# Altium schematic sheet Sensors.SchDoc
size B; SheetNumber: 3; SheetTotal: 7
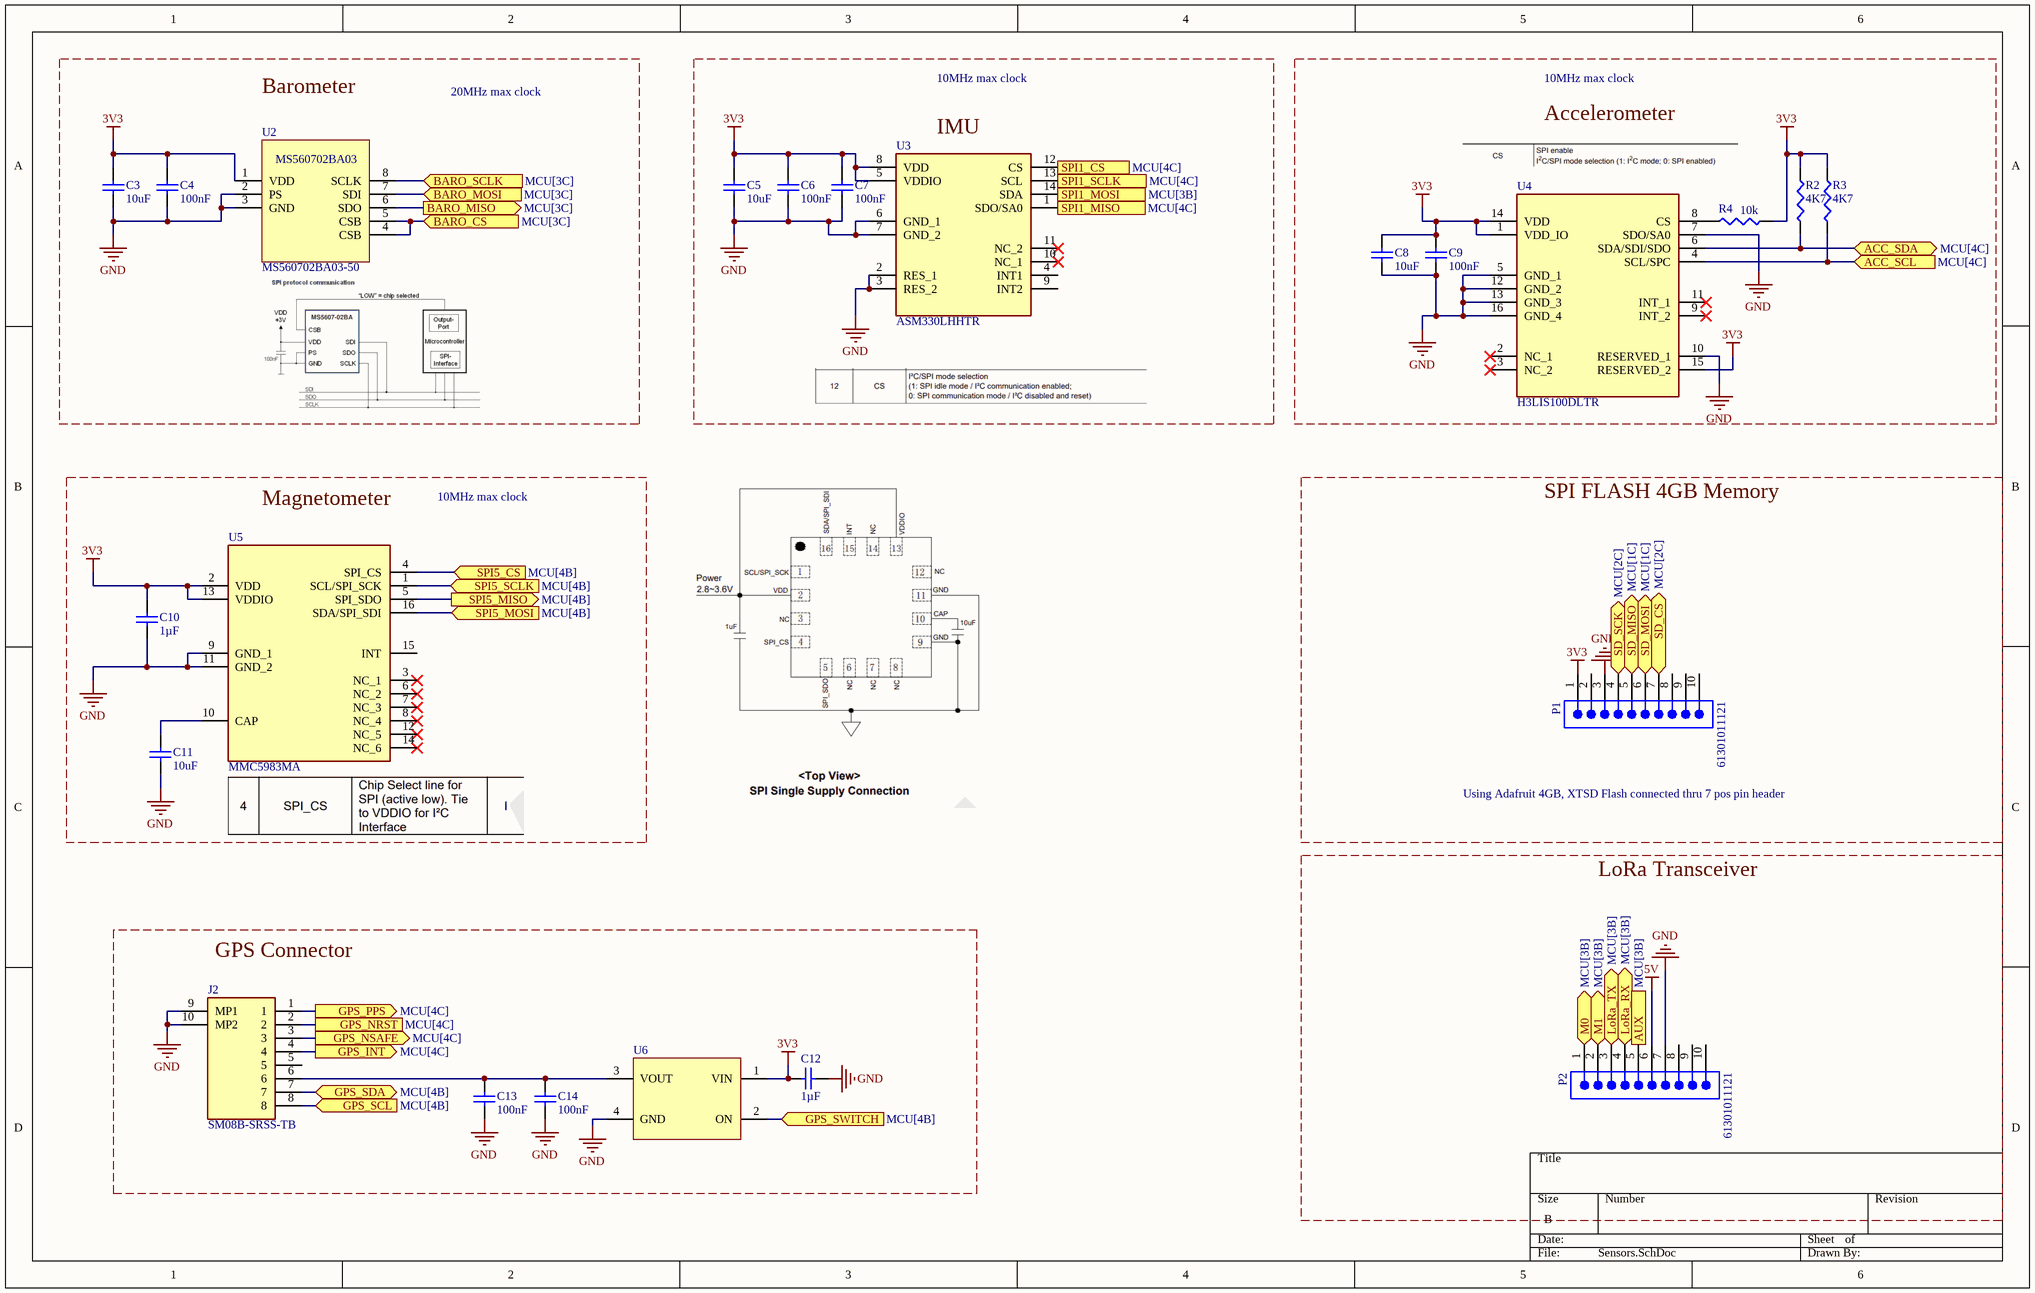
[diagram p0: Sensors.SchDoc]

## Parts
C3  10uF  [0402_C]
C4  100nF  [0402_C]
C5  10uF  [0402_C]
C6  100nF  [0402_C]
C7  100nF  [0402_C]
C8  10uF  [0402_C]
C9  100nF  [0402_C]
C10  value 1µF  [0402_C]  (hidden comment: CL05A105KL5NRNC)
C11  10uF  [0402_C]
C12  value 1µF  [0402_C]  (hidden comment: CL05A105KL5NRNC)
C13  100nF  [0402_C]
C14  100nF  [0402_C]
J2  SM08B-SRSS-TB  [SM08BSRSSTBLFSN]
P1  61301011121  [61301011121]
P2  61301011121  [61301011121]
R2  4K7  [0402_R]
R3  4K7  [0402_R]
R4  10k  [0402_R]
U2  MS560702BA03-50  [MS5607-02BA03]
U3  ASM330LHHTR  [LSM6DS3USTR]
U4  H3LIS100DLTR  [H3LIS100DLTR]
U5  MMC5983MA  [MMC5983MA_MEM]
U6  TPS22991BNRAAR  [TPS22991BNRAAR-Footprint-1]  (value not drawn)

## Blocks framed on the sheet
Barometer: C3 C4 U2
IMU: C5-C7 U3
Accelerometer: C8 C9 R2-R4 U4
Magnetometer: C10 C11 U5
SPI FLASH 4GB Memory: P1
LoRa Transceiver: P2
GPS Connector: C12-C14 J2 U6

## Ports
ACC_SCL (in, see MCU[4C]), ACC_SDA (bidir, see MCU[4C]), AUX (out, see MCU[3B]), BARO_CS (in, see MCU[3C]), BARO_MISO (out, see MCU[3C]), BARO_MOSI (in, see MCU[3C]), BARO_SCLK (in, see MCU[3C]), GPS_INT (out, see MCU[4C]), GPS_NRST (see MCU[4C]), GPS_NSAFE (out, see MCU[4C]), GPS_PPS (out, see MCU[4C]), GPS_SCL (in, see MCU[4B]), GPS_SDA (bidir, see MCU[4B]), GPS_SWITCH (in, see MCU[4B]), LoRa_RX (bidir, see MCU[3B]), LoRa_TX (bidir, see MCU[3B]), M0 (bidir, see MCU[3B]), M1 (bidir, see MCU[3B]), SD_CS (bidir, see MCU[2C]), SD_MISO (bidir, see MCU[1C]), SD_MOSI (bidir, see MCU[1C]), SD_SCK (bidir, see MCU[2C]), SPI1_CS (in, see MCU[4C]), SPI1_MISO (out, see MCU[4C]), SPI1_MOSI (in, see MCU[3B]), SPI1_SCLK (in, see MCU[4C]), SPI5_CS (in, see MCU[4B]), SPI5_MISO (out, see MCU[4B]), SPI5_MOSI (in, see MCU[4B]), SPI5_SCLK (in, see MCU[4B])

## Nets
3V3: C3.2 C4.2 C5.2 C6.2 C7.2 C8.2 C9.2 C10.2 C12.2 P1.1 R2.2 R3.2 R4.2 U2.1(VDD) U3.5(VDDIO) U3.8(VDD) U4.1(VDD_IO) U4.14(VDD) U4.15(RESERVED_2) U5.2(VDD) U5.13(VDDIO) U6.1(VIN)
5V: P2.6
GND: C3.1 C4.1 C5.1 C6.1 C7.1 C8.1 C9.1 C10.1 C11.1 C12.1 C13.1 C14.1 J2.9(MP1) J2.10(MP2) P1.3 P2.7 U2.2(PS) U2.3(GND) U3.2(RES_1) U3.3(RES_2) U3.6(GND_1) U3.7(GND_2) U4.5(GND_1) U4.7(SDO/SA0) U4.10(RESERVED_1) U4.12(GND_2) U4.13(GND_3) U4.16(GND_4) U5.9(GND_1) U5.11(GND_2) U6.4(GND)
ACC_SCL: R3.1 U4.4(SCL/SPC) ; port ACC_SCL
ACC_SDA: R2.1 U4.6(SDA/SDI/SDO) ; port ACC_SDA
AUX: P2.5 ; port AUX
BARO_CS: U2.4(CSB) U2.5(CSB) ; port BARO_CS
BARO_MISO: U2.6(SDO) ; port BARO_MISO
BARO_MOSI: U2.7(SDI) ; port BARO_MOSI
BARO_SCLK: U2.8(SCLK) ; port BARO_SCLK
GPS_INT: J2.4 ; port GPS_INT
GPS_NRST: J2.2 ; port GPS_NRST
GPS_NSAFE: J2.3 ; port GPS_NSAFE
GPS_PPS: J2.1 ; port GPS_PPS
GPS_SCL: J2.8 ; port GPS_SCL
GPS_SDA: J2.7 ; port GPS_SDA
GPS_SWITCH: U6.2(ON) ; port GPS_SWITCH
LoRa_RX: P2.4 ; port LoRa_RX
LoRa_TX: P2.3 ; port LoRa_TX
M0: P2.1 ; port M0
M1: P2.2 ; port M1
SD_CS: P1.7 ; port SD_CS
SD_MISO: P1.5 ; port SD_MISO
SD_MOSI: P1.6 ; port SD_MOSI
SD_SCK: P1.4 ; port SD_SCK
SPI1_CS: U3.12(CS) ; port SPI1_CS
SPI1_MISO: U3.1(SDO/SA0) ; port SPI1_MISO
SPI1_MOSI: U3.14(SDA) ; port SPI1_MOSI
SPI1_SCLK: U3.13(SCL) ; port SPI1_SCLK
SPI5_CS: U5.4(SPI_CS) ; port SPI5_CS
SPI5_MISO: U5.5(SPI_SDO) ; port SPI5_MISO
SPI5_MOSI: U5.16(SDA/SPI_SDI) ; port SPI5_MOSI
SPI5_SCLK: U5.1(SCL/SPI_SCK) ; port SPI5_SCLK
NetC11_2: C11.2 U5.10(CAP)
NetC13_2: C13.2 C14.2 J2.6 U6.3(VOUT)
NetR4_1: R4.1 U4.8(CS)

Not connected (* = marked no-connect by the designer): J2 5; P1 2 8 9 10; P2 8 9 10; U3 4(INT1) 9(INT2) 10(NC_1)* 11(NC_2)*; U4 2(NC_1)* 3(NC_2)* 9(INT_2)* 11(INT_1)*; U5 3(NC_1)* 6(NC_2)* 7(NC_3)* 8(NC_4)* 12(NC_5)* 14(NC_6)* 15(INT)

## Notes on the sheet
- 20MHz max clock
- 10MHz max clock
- Using Adafruit 4GB, XTSD Flash connected thru 7 pos pin header
- (in symbol MS560702BA03-50) MS560702BA03

## Library data of the parts
C3 C5 C8 C11 = C_10uF_0402: Ceramic Capacitor, Multilayer, Ceramic, 10V, 20% +Tol, 20% -Tol, X5R, +-15% TC, 10uF, Surface Mount, 0402 inch; Manufacturer: Samsung Electro-Mechanics; Manufacturer Part Number: CL05A106MP5NUNC; Value: 10µF; LCSC Part #: C315248; Supplier: DigiKey; Supplier Part Number: 1276-1450-1-ND; RoHS: Compliant; Category: Ceramic Capacitors; Stock: 1973072; Pricing: 1=0.08, 10=0.038, 50=0.034, 100=0.0296, 500=0.0272, 1000=0.02, 2500=0.01844 (USD); Case/Package: 0402; Case Code (Imperial): 0402; Case Code (Metric): 1005; China RoHS: Compliant; Contact Plating: Tin; Depth: 500µm; Dielectric: X5R; Dielectric Material: Ceramic; Height: 700µm; Lead Free: Lead Free; Length: 1mm; Lifecycle Status: NRND; Material: Ceramic; Max Operating Temperature: 85°C; Min Operating Temperature: -55°C; Mounting Technology: Surface Mount; Number of Terminals: 2; Packaging: Tape and Reel; Radiation Hardening: No; REACH SVHC: Yes; Schedule B: 8532240020, 8532240020|8532240020|8532240020|8532240020|8532240020|8532240020|8532240020|8532240020|8532240020|8532240020|8532240020|8532240020|8532240020|8532240020|8532240020|8532240020|8532240020|8532240020|8532240020|8532240020|8532240020|8532240020|8532240020|85; Termination: Wraparound; Thickness: 711.2µm; Tolerance: 20%; Voltage Rating: 10V; Voltage Rating (DC): 10V; Width: 500µm; ComponentLink1URL: https://datasheet.octopart.com:443/CL05A106MP5NUNC-Samsung-Electro-Mechanics-datasheet-182018593.pdf?src-supplier=IHS; ComponentLink1Description: https://datasheet.octopart.com:443/CL05A106MP5NUNC-Samsung-Electro-Mechanics-datasheet-182018593.pdf?src-supplier=IHS; ComponentLink2URL: https://datasheet.octopart.com:443/CL05A106MP5NUNC-Samsung-Electro-Mechanics-datasheet-136031723.pdf?src-supplier=Upverter; ComponentLink2Description: https://datasheet.octopart.com:443/CL05A106MP5NUNC-Samsung-Electro-Mechanics-datasheet-136031723.pdf?src-supplier=Upverter; ComponentLink3URL: https://datasheet.octopart.com:443/CL05A106MP5NUNC-Samsung-Electro-Mechanics-datasheet-110226206.pdf?src-supplier=Future+Electronics; ComponentLink3Description: https://datasheet.octopart.com:443/CL05A106MP5NUNC-Samsung-Electro-Mechanics-datasheet-110226206.pdf?src-supplier=Future+Electronics; ComponentLink4URL: https://datasheet.octopart.com:443/CL05A106MP5NUNC-Samsung-Electro-Mechanics-datasheet-87580039.pdf?src-supplier=Future+Electronics; ComponentLink4Description: https://datasheet.octopart.com:443/CL05A106MP5NUNC-Samsung-Electro-Mechanics-datasheet-87580039.pdf?src-supplier=Future+Electronics; ComponentLink5URL: https://datasheet.octopart.com:443/CL05A106MP5NUNC-Samsung-Electro-Mechanics-datasheet-81461595.pdf?src-supplier=Future+Electronics; ComponentLink5Description: https://datasheet.octopart.com:443/CL05A106MP5NUNC-Samsung-Electro-Mechanics-datasheet-81461595.pdf?src-supplier=Future+Electronics; ComponentLink6URL: https://datasheet.octopart.com:443/CL05A106MP5NUNC-Samsung-datasheet-42280527.pdf?src-supplier=Future+Electronics; ComponentLink6Description: https://datasheet.octopart.com:443/CL05A106MP5NUNC-Samsung-datasheet-42280527.pdf?src-supplier=Future+Electronics; ComponentLink7URL: https://datasheet.octopart.com:443/CL05A106MP5NUNC-Samsung-datasheet-34153002.pdf?src-supplier=Future+Electronics; ComponentLink7Description: https://datasheet.octopart.com:443/CL05A106MP5NUNC-Samsung-datasheet-34153002.pdf?src-supplier=Future+Electronics; ComponentLink8URL: https://datasheet.octopart.com:443/CL05A106MP5NUNC-Samsung-datasheet-25077983.pdf?src-supplier=Future+Electronics; ComponentLink8Description: https://datasheet.octopart.com:443/CL05A106MP5NUNC-Samsung-datasheet-25077983.pdf?src-supplier=Future+Electronics; ComponentLink9URL: https://datasheet.octopart.com:443/CL05A106MP5NUNC-Samsung-Electro-Mechanics-datasheet-149136670.pdf?src-supplier=Future+Electronics; ComponentLink9Description: https://datasheet.octopart.com:443/CL05A106MP5NUNC-Samsung-Electro-Mechanics-datasheet-149136670.pdf?src-supplier=Future+Electronics; ComponentLink10URL: https://datasheet.octopart.com:443/CL05A106MP5NUNC-Samsung-datasheet-8326407.pdf?src-supplier=TME; ComponentLink10Description: https://datasheet.octopart.com:443/CL05A106MP5NUNC-Samsung-datasheet-8326407.pdf?src-supplier=TME
C4 C6 C7 C9 C13 C14 = C_100nF_0402: Ceramic Capacitor, Multilayer, Ceramic, 16V, 10% +Tol, 10% -Tol, X7R, +-15% TC, 100nF, Surface Mount, 0402 inch; Manufacturer: Samsung Electro-Mechanics; Manufacturer Part Number: CL05B104KO5NNNC; Supplier: DigiKey; Supplier Part Number: 1276-1001-1-ND; RoHS: Compliant; Category: Ceramic Capacitors; Stock: 253470; Pricing: 1=0.08, 10=0.009, 50=0.0076, 100=0.0064, 500=0.0056, 1000=0.004, 2500=0.00394 (USD); Value: 100nF; Case/Package: 0402; Case Code (Imperial): 0402; Case Code (Metric): 1005; China RoHS: Compliant; Contact Plating: Tin; Depth: 500µm; Dielectric: X7R; Dielectric Material: Ceramic; Height: 500µm; Lead Free: Lead Free; Length: 1mm; Lifecycle Status: Production; Material: Ceramic; Max Operating Temperature: 125°C; Min Operating Temperature: -55°C; Mounting Technology: Surface Mount; Number of Terminals: 2; Radiation Hardening: No; REACH SVHC: Yes; Schedule B: 8532240020, 8532240020|8532240020|8532240020|8532240020|8532240020|8532240020|8532240020|8532240020|8532240020|8532240020|8532240020|8532240020|8532240020|8532240020|8532240020|8532240020|8532240020|8532240020|8532240020|8532240020|8532240020|8532240020|8532240020|85; Thickness: 558.8µm; Tolerance: 10%; Voltage: 16V; Voltage Rating: 16V; Voltage Rating (DC): 16V; Width: 500µm; ComponentLink1URL: https://datasheet.octopart.com:443/CL05B104KO5NNNC-Samsung-Electro-Mechanics-datasheet-181960518.pdf?src-supplier=IHS; ComponentLink1Description: https://datasheet.octopart.com:443/CL05B104KO5NNNC-Samsung-Electro-Mechanics-datasheet-181960518.pdf?src-supplier=IHS; ComponentLink2URL: https://datasheet.octopart.com:443/CL05B104KO5NNNC-Samsung-Electro-Mechanics-datasheet-81461623.pdf?src-supplier=Upverter; ComponentLink2Description: https://datasheet.octopart.com:443/CL05B104KO5NNNC-Samsung-Electro-Mechanics-datasheet-81461623.pdf?src-supplier=Upverter; ComponentLink3URL: https://datasheet.octopart.com/CL05B104KO5NNNC-Samsung-Electro-Mechanics-datasheet-8324245.pdf; ComponentLink3Description: https://datasheet.octopart.com/CL05B104KO5NNNC-Samsung-Electro-Mechanics-datasheet-8324245.pdf; ComponentLink4URL: https://datasheet.octopart.com/CL05B104KO5NNNC-Samsung-Electro-Mechanics-datasheet-97040617.pdf; ComponentLink4Description: https://datasheet.octopart.com/CL05B104KO5NNNC-Samsung-Electro-Mechanics-datasheet-97040617.pdf; ComponentLink5URL: https://datasheet.octopart.com/General-Multilayer-Ceramic-Capacitors-Samsung-datasheet-family-111.pdf; ComponentLink5Description: https://datasheet.octopart.com/General-Multilayer-Ceramic-Capacitors-Samsung-datasheet-family-111.pdf; ComponentLink6URL: https://datasheet.octopart.com:443/CL05B104KO5NNNC-Samsung-Electro-Mechanics-datasheet-141346863.pdf?src-supplier=Samsung+SCT; ComponentLink6Description: https://datasheet.octopart.com:443/CL05B104KO5NNNC-Samsung-Electro-Mechanics-datasheet-141346863.pdf?src-supplier=Samsung+SCT; ComponentLink7URL: https://datasheet.octopart.com:443/CL05B104KO5NNNC-Samsung-datasheet-151956582.pdf?src-supplier=SOS+electronic; ComponentLink7Description: https://datasheet.octopart.com:443/CL05B104KO5NNNC-Samsung-datasheet-151956582.pdf?src-supplier=SOS+electronic; ComponentLink8URL: https://datasheet.octopart.com:443/CL05B104KO5NNNC-Samsung-datasheet-42485123.pdf?src-supplier=Future+Electronics; ComponentLink8Description: https://datasheet.octopart.com:443/CL05B104KO5NNNC-Samsung-datasheet-42485123.pdf?src-supplier=Future+Electronics; ComponentLink9URL: https://datasheet.octopart.com:443/CL05B104KO5NNNC-Samsung-datasheet-34153835.pdf?src-supplier=Future+Electronics; ComponentLink9Description: https://datasheet.octopart.com:443/CL05B104KO5NNNC-Samsung-datasheet-34153835.pdf?src-supplier=Future+Electronics; ComponentLink10URL: https://datasheet.octopart.com:443/CL05B104KO5NNNC-Samsung-datasheet-26589024.pdf?src-supplier=Future+Electronics; ComponentLink10Description: https://datasheet.octopart.com:443/CL05B104KO5NNNC-Samsung-datasheet-26589024.pdf?src-supplier=Future+Electronics; ComponentLink11URL: https://datasheet.octopart.com:443/CL05B104KO5NNNC-Samsung-Electro-Mechanics-datasheet-149136714.pdf?src-supplier=Future+Electronics; ComponentLink11Description: https://datasheet.octopart.com:443/CL05B104KO5NNNC-Samsung-Electro-Mechanics-datasheet-149136714.pdf?src-supplier=Future+Electronics; ComponentLink12URL: https://datasheet.octopart.com:443/CL05B104KO5NNNC-Samsung-datasheet-59220082.pdf?src-supplier=TME; ComponentLink12Description: https://datasheet.octopart.com:443/CL05B104KO5NNNC-Samsung-datasheet-59220082.pdf?src-supplier=TME; ComponentLink13URL: http://sigma.octopart.com:80/rohs_certificate/General-Multilayer-Ceramic-Capacitors-Samsung-family-110.pdf?src-supplier=Compliance+Statements; ComponentLink13Description: http://sigma.octopart.com:80/rohs_certificate/General-Multilayer-Ceramic-Capacitors-Samsung-family-110.pdf?src-supplier=Compliance+Statements; ComponentLink14URL: http://sigma.octopart.com:80/rohs_statement/General-Multilayer-Ceramic-Capacitors-Samsung-family-132.pdf?src-supplier=Compliance+Statements; ComponentLink14Description: http://sigma.octopart.com:80/rohs_statement/General-Multilayer-Ceramic-Capacitors-Samsung-family-132.pdf?src-supplier=Compliance+Statements; ComponentLink15URL: http://sigma.octopart.com:80/reach_statement/General-Multilayer-Ceramic-Capacitors-Samsung-family-133.pdf?src-supplier=Compliance+Statements; ComponentLink15Description: http://sigma.octopart.com:80/reach_statement/General-Multilayer-Ceramic-Capacitors-Samsung-family-133.pdf?src-supplier=Compliance+Statements; LCSC Part #: C1525
C10 C12 = CMP-001-00091-2: Ceramic Capacitor, Multilayer, Ceramic, 35V, 10% +Tol, 10% -Tol, X5R, 15% TC, 1uF, Surface Mount, 0402; Manufacturer: Samsung; Tolerance: 1%; Working Voltage: 50V; Temperature Coefficient: 100ppm/°C; Rated Temperature: 70°C; Power: 62.5mW; Multilayer: Yes; Reference Standard: AEC-Q200; Package Height: 0.32mm; Additional Feature: LASER TRIMMABLE; Package Width: 0.5mm; Package Length: 1mm; RoHS Compliant: Yes; Rated DC Voltage (URdc): 35V; Termination: Wraparound; ComponentLink1URL: https://datasheet.ciiva.com:443/pdfs/VipMasterIC/IC/SEMS/SEMS-S-A0008384515/SEMS-S-A0008872905-1.pdf?src-supplier=IHS+Markit; Tolerance  (fill in as +-): 10%; Technology: METAL GLAZE/THICK FILM; Construction: Chip; Max Operating Temperature: 85°C; ComponentLink2URL: http://www.samsungsem.com/kr/support/product-search/mlcc/CL05A105KL5NRNC.jsp?src-supplier=Digikey; Pricing: 1=0.31, 10=0.181, 50=0.1296, 100=0.1136, 500=0.08658, 1000=0.07816, 2500=0.06921, 5000=0.06379, 10000=0.0593, 20000=0.05558, 30000=0.0537, 50000=0.05162, 70000=0.0504, 100000=0.04922 (USD); ComponentLink4Description: https://datasheet.ciiva.com:443/pdfs/VipMasterIC/IC/YAGO/YAGO-S-A0003597364/YAGO-S-A0003597364-1.pdf?src-supplier=IHS+Markit; Mounting Technology: Surface Mount; Stock: 299048; LCSC Part Number: C307413; Terminal Finish: Nickel; JESD-609 Code: e3; Dielectric Material: Ceramic; Tolerance (fill in as +-): 10%; ComponentLink4URL: https://datasheet.ciiva.com:443/pdfs/VipMasterIC/IC/YAGO/YAGO-S-A0003597364/YAGO-S-A0003597364-1.pdf?src-supplier=IHS+Markit; Pins: 2; ComponentLink5Description: https://datasheet.ciiva.com/12656/pyu-ac-51-rohs-l-2-12656634.pdf?src-supplier=Mouser; ComponentLink1Description: https://datasheet.ciiva.com:443/pdfs/VipMasterIC/IC/SEMS/SEMS-S-A0008384515/SEMS-S-A0008872905-1.pdf?src-supplier=IHS+Markit; ComponentLink3URL: https://datasheet.octopart.com/CL05A105KL5NRNC-Samsung-datasheet-8326407.pdf?src-supplier=TME; Min Operating Temperature: -55°C; ComponentLink2Description: http://www.samsungsem.com/kr/support/product-search/mlcc/CL05A105KL5NRNC.jsp?src-supplier=Digikey; Component Type: Standard; Package Style: SMTMeter; ComponentLink3Description: https://datasheet.octopart.com/CL05A105KL5NRNC-Samsung-datasheet-8326407.pdf?src-supplier=TME; Temperature Characteristics Code: X5R; Reach SVHC Compliant: Yes; Category: Ceramic Capacitors; Capacitor Type: Ceramic; RoHS: Yes; Case/Package: 0402; Package Shape: Rectangular; Design Item ID: CL05A105KL5NRNC; Manufacturer Part Number: CL05A105KL5NRNC; Packaging: Tape and Reel; Resistor Type: FIXED RESISTOR; ComponentLink5URL: https://datasheet.ciiva.com/12656/pyu-ac-51-rohs-l-2-12656634.pdf?src-supplier=Mouser; Source: Hybrids_Avionics.SCHLIB
J2 = SM08B-SRSS-TB_LF__SN_: CONN HEADER SMD R/A 8POS 1MM; Manufacturer_Name: JST (JAPAN SOLDERLESS TERMINALS); Manufacturer_Part_Number: SM08B-SRSS-TB(LF)(SN); Manufacturer: JST; Connector Type: Male Pin; Contact Resistance: 40mΩ; Current Rating: 1A; Dielectric Material: Polyamide; Gender: Male; Insulation Resistance: 100MΩ; Number of Contacts: 8; Pitch: 990.6µm; Voltage Rating: 50V; Datasheet Link: https://www.jst-mfg.com/product/pdf/eng/eSH.pdf?681342af00cbd; Height: 2.95mm; Mouser Part Number: N/A; Mouser Price/Stock: https://www.mouser.co.uk/ProductDetail/JST-Commercial/SM08B-SRSS-TBLFSN?qs=QpmGXVUTftEPqGOAsnf4nQ%3D%3D; Arrow Part Number: SM08B-SRSS-TB(LF)(SN); Arrow Price/Stock: https://www.arrow.com/en/products/sm08b-srss-tb-lf-sn/jst-manufacturing?utm_currency=USD&region=europe; Supplier: Mouser; Supplier Part Number: 306-SM08BSRSSTBLFSN; Manufacturer Part Number: SM08B-SRSS-TB(LF)(SN); RoHS: Compliant; Category: Headers and Wire Housings; Stock: 10177; Pricing: 1=1.22, 10=1.08, 50=1.08, 100=0.922, 1000=0.813, 10000=0.691 (USD); China RoHS: Compliant; Color: Natural; Contact Gender: Male; Contact Material: Copper, Tin; Contact Plating: Tin; Flammability Rating: UL94 V-0; Housing Color: Natural; Housing Material: Nylon; Lead Free: Lead Free; Lead Pitch: 1mm; Lifecycle Status: Production; Material: Polyamide; Max Operating Temperature: 85°C; Min Operating Temperature: -25°C; Mounting Technology: Surface Mount; Pins: 8; Number of Positions: 8; Number of Rows: 1; Packaging: Cut Tape; REACH SVHC: Yes; Terminal Pitch: 1mm; Termination: Solder; Voltage Rating (AC): 50V; ComponentLink1URL: https://datasheet.octopart.com:443/SM08B-SRSS-TB%28LF%29%28SN%29-JST-datasheet-12489618.pdf?src-supplier=Upverter; ComponentLink1Description: https://datasheet.octopart.com:443/SM08B-SRSS-TB%28LF%29%28SN%29-JST-datasheet-12489618.pdf?src-supplier=Upverter; ComponentLink2URL: https://datasheet.octopart.com:443/SM08B-SRSS-TB%28LF%29%28SN%29-JST-datasheet-152738602.pdf?src-supplier=Upverter; ComponentLink2Description: https://datasheet.octopart.com:443/SM08B-SRSS-TB%28LF%29%28SN%29-JST-datasheet-152738602.pdf?src-supplier=Upverter; ComponentLink3URL: https://datasheet.octopart.com:443/SM08B-SRSS-TB%28LF%29%28SN%29-JST-datasheet-8330955.pdf?src-supplier=Upverter; ComponentLink3Description: https://datasheet.octopart.com:443/SM08B-SRSS-TB%28LF%29%28SN%29-JST-datasheet-8330955.pdf?src-supplier=Upverter; ComponentLink4URL: https://datasheet.octopart.com:443/SM08B-SRSS-TB%28LF%29%28SN%29-JST-datasheet-5322443.pdf?src-supplier=element14+APAC; ComponentLink4Description: https://datasheet.octopart.com:443/SM08B-SRSS-TB%28LF%29%28SN%29-JST-datasheet-5322443.pdf?src-supplier=element14+APAC; ComponentLink5URL: https://datasheet.octopart.com:443/SM08B-SRSS-TB%28LF%29%28SN%29-JST-datasheet-65849987.pdf?src-supplier=element14+APAC; ComponentLink5Description: https://datasheet.octopart.com:443/SM08B-SRSS-TB%28LF%29%28SN%29-JST-datasheet-65849987.pdf?src-supplier=element14+APAC; ComponentLink6URL: https://datasheet.octopart.com:443/SM08B-SRSS-TB%28LF%29%28SN%29-JST-datasheet-12513377.pdf?src-supplier=Future+Electronics; ComponentLink6Description: https://datasheet.octopart.com:443/SM08B-SRSS-TB%28LF%29%28SN%29-JST-datasheet-12513377.pdf?src-supplier=Future+Electronics; ComponentLink7URL: https://datasheet.octopart.com:443/SM08B-SRSS-TB/LF/SN-JST-datasheet-120967.pdf?src-supplier=Future+Electronics; ComponentLink7Description: https://datasheet.octopart.com:443/SM08B-SRSS-TB/LF/SN-JST-datasheet-120967.pdf?src-supplier=Future+Electronics; ComponentLink8URL: https://datasheet.octopart.com:443/SM08B-SRSS-TB-%28LF%29%28SN%29-JST-datasheet-44103209.pdf?src-supplier=TME; ComponentLink8Description: https://datasheet.octopart.com:443/SM08B-SRSS-TB-%28LF%29%28SN%29-JST-datasheet-44103209.pdf?src-supplier=TME; ComponentLink9URL: https://datasheet.octopart.com:443/SM08B-SRSS-TB%28LF%29%28SN%29-JST-datasheet-119911.pdf?src-supplier=DigiKey; ComponentLink9Description: https://datasheet.octopart.com:443/SM08B-SRSS-TB%28LF%29%28SN%29-JST-datasheet-119911.pdf?src-supplier=DigiKey; LCSC Part #: C160407
P1 P2 = CMP-1502-01082-6: THT Vertical Pin Header WR-PHD, Pitch 2.54 mm, Single Row, 10 pins; Gender: Male; Voltage Rating: 250V; Connector Type: Male Pin; Current Rating: 3A; Number of Contacts: 10; Pitch: 2.54mm; Contact Resistance: 20mΩ; Insulation Resistance: 1GΩ; RoHS: Compliant; Length: 2.54mm; Max Operating Temperature: 105°C; Flammability Rating: UL94 V-0; Width: 25.4mm; Number of Positions: 10; Number of Rows: 1; Lead Pitch: 2.54mm; Number of Pins: 10; Termination: Solder; Operating Supply Voltage: 250V; Color: Black; Housing Material: PBT; Orientation: Vertical; Packaging: Bulk; Mount: Through Hole; Contact Mating Length: 5.9944mm; Contact Material: Gold; Height: 8.74mm; Min Operating Temperature: -40°C; Contact Plating: Gold; Contact Gender: Male
R2 R3 = R_4K7_0402_1: RES 4.7K OHM 1% 1/16W 0402; Manufacturer: TE Connectivity; Manufacturer Part Number: CRGCQ0402F4K7; Manufacturer Lifecycle Status: ACTIVE; Working Voltage: 50V; Power Dissipation: 63mW; Power Rating: 62.5mW; Value: 4.7kΩ; Temperature Coefficient: 100ppm/°C; Supplier: DigiKey; Supplier Part Number: A129635CT-ND; RoHS: Compliant; Category: Chip SMD Resistors; Stock: 1741618; Pricing: 1=0.1, 10=0.025, 25=0.0184, 50=0.0148, 100=0.0121, 250=0.00936, 500=0.00784, 1000=0.00663, 5000=0.00473 (USD); Ambient Temperature Range High: 70°C; Case/Package: 0402; China RoHS: Non-Compliant; Composition: Thick Film; Height: 350µm; Lifecycle Status: Production; Max Operating Temperature: 155°C; Min Operating Temperature: -55°C; Mounting Technology: Surface Mount; Number of Terminals: 2; Operating Supply Voltage: 50V; Packaging: Cut Tape; REACH SVHC: Yes; Schedule B: 8533210025, 8533210025|8533210025|8533210025|8533210025|8533210025, 8533210045; Tolerance: 1%; Voltage Rating: 50V; Voltage Rating (DC): 50V; Width: 500µm; ComponentLink1URL: https://datasheet.octopart.com:443/CRGCQ0402F4K7-TE-Connectivity-datasheet-114679081.pdf?src-supplier=Master+Electronics; ComponentLink1Description: https://datasheet.octopart.com:443/CRGCQ0402F4K7-TE-Connectivity-datasheet-114679081.pdf?src-supplier=Master+Electronics; ComponentLink2URL: https://datasheet.octopart.com:443/3-2176337-3-TE-Connectivity---AMP-datasheet-189108688.pdf?src-supplier=Master+Electronics; ComponentLink2Description: https://datasheet.octopart.com:443/3-2176337-3-TE-Connectivity---AMP-datasheet-189108688.pdf?src-supplier=Master+Electronics; ComponentLink3URL: https://datasheet.octopart.com:443/CRGCQ0402F4K7-TE-Connectivity-datasheet-179146952.pdf?src-supplier=IHS; ComponentLink3Description: https://datasheet.octopart.com:443/CRGCQ0402F4K7-TE-Connectivity-datasheet-179146952.pdf?src-supplier=IHS; ComponentLink4URL: https://sigma.octopart.com:443/114679084/technical_drawing/TE-Connectivity-CRGCQ0402F4K7.pdf?src-supplier=Sager+Electronics; ComponentLink4Description: https://sigma.octopart.com:443/114679084/technical_drawing/TE-Connectivity-CRGCQ0402F4K7.pdf?src-supplier=Sager+Electronics; ComponentLink5URL: http://sigma.octopart.com:80/117256993/reach_statement/TE-Connectivity-CRGCQ0402F4K7.pdf?src-supplier=Compliance+Statements; ComponentLink5Description: http://sigma.octopart.com:80/117256993/reach_statement/TE-Connectivity-CRGCQ0402F4K7.pdf?src-supplier=Compliance+Statements; LCSC Part #: C2073585
R4 = R_10k_0402: RES SMD 10K OHM 0.1% 1/16W 0402; Manufacturer: Yageo Group; Manufacturer Part Number: RC0402FR-071KL; Power Dissipation: 62.5mW; Power Rating: 63mW; Value: 10kΩ; Temperature Coefficient: 100ppm/°C; Tolerance: 1%; Voltage Rating: 50V; LCSC Part #: C191915; Supplier: DigiKey; Supplier Part Number: 311-1.00KLRTR-ND; RoHS: Compliant; Category: Chip SMD Resistors; Stock: 4926888; Pricing: 10000=0.00204, 20000=0.002, 30000=0.00196, 50000=0.00182, 70000=0.00181 (USD); Case/Package: 0402; Case Code (Imperial): 0402; Case Code (Metric): 0402; China RoHS: Non-Compliant; Composition: Thick Film; Depth: 500µm; Height: 350µm; Lead Free: Lead Free; Length: 1mm; Lifecycle Status: Production; Max Operating Temperature: 155°C; Military Standard: Not; Min Operating Temperature: -55°C; Mounting Technology: Surface Mount; Pins: 2; Number of Terminals: 2; Packaging: Tape & Reel; REACH SVHC: Yes; Schedule B: 8533210045, 8533210045|8533210045|8533210045|8533210045|8533210045|8533210045|8533210045|8533210045|8533210045|8533210045|8533210045|8533210045|8533210045|8533210045|8533210045|8533210045|8533210045|8533210045|8533210045|8533210045|8533210045|8533210045|8533210045|85; Termination: SMD/SMT; Voltage Rating (AC): 50V; Voltage Rating (DC): 50V; Width: 500µm; Working Voltage: 50V; ComponentLink1URL: https://datasheet.octopart.com:443/RC0402FR-071KL-Yageo-datasheet-175887523.pdf?src-supplier=IHS; ComponentLink1Description: https://datasheet.octopart.com:443/RC0402FR-071KL-Yageo-datasheet-175887523.pdf?src-supplier=IHS; ComponentLink2URL: https://datasheet.octopart.com:443/RC0402FR-071KL-Yageo-datasheet-164759695.pdf?src-supplier=Upverter; ComponentLink2Description: https://datasheet.octopart.com:443/RC0402FR-071KL-Yageo-datasheet-164759695.pdf?src-supplier=Upverter; ComponentLink3URL: https://datasheet.octopart.com:443/RC0402FR-071KL-Yageo-datasheet-103092701.pdf?src-supplier=Upverter; ComponentLink3Description: https://datasheet.octopart.com:443/RC0402FR-071KL-Yageo-datasheet-103092701.pdf?src-supplier=Upverter; ComponentLink4URL: https://sigma.octopart.com:443/138820526/technical_drawing/Yageo-RC0402FR-071KL.pdf?src-supplier=Upverter; ComponentLink4Description: https://sigma.octopart.com:443/138820526/technical_drawing/Yageo-RC0402FR-071KL.pdf?src-supplier=Upverter; ComponentLink5URL: https://datasheet.octopart.com:443/RC0402FR-071KL-Yageo-datasheet-98239111.pdf?src-supplier=Upverter; ComponentLink5Description: https://datasheet.octopart.com:443/RC0402FR-071KL-Yageo-datasheet-98239111.pdf?src-supplier=Upverter; ComponentLink6URL: https://datasheet.octopart.com:443/RC0402FR-071KL-Yageo-datasheet-10408619.pdf?src-supplier=Newark; ComponentLink6Description: https://datasheet.octopart.com:443/RC0402FR-071KL-Yageo-datasheet-10408619.pdf?src-supplier=Newark; ComponentLink7URL: https://datasheet.octopart.com:443/RC0402FR-071KL-Yageo-datasheet-8324527.pdf?src-supplier=Newark; ComponentLink7Description: https://datasheet.octopart.com:443/RC0402FR-071KL-Yageo-datasheet-8324527.pdf?src-supplier=Newark; ComponentLink8URL: https://datasheet.octopart.com:443/RC0402FR-071KL-Yageo-datasheet-62067350.pdf?src-supplier=Farnell; ComponentLink8Description: https://datasheet.octopart.com:443/RC0402FR-071KL-Yageo-datasheet-62067350.pdf?src-supplier=Farnell; ComponentLink9URL: https://datasheet.octopart.com:443/RC0402FR-071KL-Yageo-datasheet-12531192.pdf?src-supplier=Future+Electronics; ComponentLink9Description: https://datasheet.octopart.com:443/RC0402FR-071KL-Yageo-datasheet-12531192.pdf?src-supplier=Future+Electronics; ComponentLink10URL: https://datasheet.octopart.com:443/RC0402FR-071KL-Yageo-datasheet-137700087.pdf?src-supplier=Future+Electronics; ComponentLink10Description: https://datasheet.octopart.com:443/RC0402FR-071KL-Yageo-datasheet-137700087.pdf?src-supplier=Future+Electronics; ComponentLink11URL: https://datasheet.octopart.com:443/RC0402FR-071KL-Yageo-datasheet-8324255.pdf?src-supplier=Future+Electronics; ComponentLink11Description: https://datasheet.octopart.com:443/RC0402FR-071KL-Yageo-datasheet-8324255.pdf?src-supplier=Future+Electronics; ComponentLink12URL: https://datasheet.octopart.com:443/RC0402FR-071KL-Yageo-datasheet-8329306.pdf?src-supplier=element14; ComponentLink12Description: https://datasheet.octopart.com:443/RC0402FR-071KL-Yageo-datasheet-8329306.pdf?src-supplier=element14; ComponentLink13URL: https://datasheet.octopart.com:443/RC0402FR-071KL-Yageo-datasheet-505231.pdf?src-supplier=element14; ComponentLink13Description: https://datasheet.octopart.com:443/RC0402FR-071KL-Yageo-datasheet-505231.pdf?src-supplier=element14; ComponentLink14URL: https://datasheet.octopart.com:443/RC0402FR-071KL-Yageo-datasheet-175423674.pdf?src-supplier=SOS+electronic; ComponentLink14Description: https://datasheet.octopart.com:443/RC0402FR-071KL-Yageo-datasheet-175423674.pdf?src-supplier=SOS+electronic; ComponentLink15URL: https://datasheet.octopart.com:443/RC0402FR-071KL-Yageo-datasheet-148775077.pdf?src-supplier=TME; ComponentLink15Description: https://datasheet.octopart.com:443/RC0402FR-071KL-Yageo-datasheet-148775077.pdf?src-supplier=TME; ComponentLink16URL: https://datasheet.octopart.com:443/RC0402FR-071KL-Yageo-datasheet-79472498.pdf?src-supplier=Megastar; ComponentLink16Description: https://datasheet.octopart.com:443/RC0402FR-071KL-Yageo-datasheet-79472498.pdf?src-supplier=Megastar; ComponentLink17URL: https://datasheet.octopart.com/RC0402FR-071KL-Yageo-datasheet-73766026.pdf; ComponentLink17Description: https://datasheet.octopart.com/RC0402FR-071KL-Yageo-datasheet-73766026.pdf; ComponentLink18URL: http://sigma.octopart.com:80/rohs_statement/Yageo-company-2.pdf?src-supplier=Compliance+Statements; ComponentLink18Description: http://sigma.octopart.com:80/rohs_statement/Yageo-company-2.pdf?src-supplier=Compliance+Statements; ComponentLink19URL: http://sigma.octopart.com:80/conflict_mineral_statement/Yageo-company-3.pdf?src-supplier=Compliance+Statements; ComponentLink19Description: http://sigma.octopart.com:80/conflict_mineral_statement/Yageo-company-3.pdf?src-supplier=Compliance+Statements; Contact Plating: Tin; Features: Automotive AEC-Q200; Max Power Dissipation: 63mW; Number of Terminations: 2; Radiation Hardening: No; ComponentLink20URL: https://sigma.octopart.com:443/138766958/technical_drawing/Panasonic-ERA-2AEB103X.pdf?src-supplier=Upverter; ComponentLink20Description: https://sigma.octopart.com:443/138766958/technical_drawing/Panasonic-ERA-2AEB103X.pdf?src-supplier=Upverter; ComponentLink21URL: https://datasheet.octopart.com:443/ERA-2AEB103X-Panasonic-datasheet-62287448.pdf?src-supplier=Future+Electronics; ComponentLink21Description: https://datasheet.octopart.com:443/ERA-2AEB103X-Panasonic-datasheet-62287448.pdf?src-supplier=Future+Electronics; ComponentLink22URL: https://datasheet.octopart.com:443/ERA-2AEB103X-Panasonic-datasheet-12510007.pdf?src-supplier=Future+Electronics; ComponentLink22Description: https://datasheet.octopart.com:443/ERA-2AEB103X-Panasonic-datasheet-12510007.pdf?src-supplier=Future+Electronics; ComponentLink23URL: https://datasheet.octopart.com:443/ERA-2AEB103X-Panasonic-datasheet-11763931.pdf?src-supplier=Future+Electronics; ComponentLink23Description: https://datasheet.octopart.com:443/ERA-2AEB103X-Panasonic-datasheet-11763931.pdf?src-supplier=Future+Electronics; ComponentLink24URL: https://datasheet.octopart.com:443/ERA-2AEB103X-Panasonic-datasheet-10840895.pdf?src-supplier=Future+Electronics; ComponentLink24Description: https://datasheet.octopart.com:443/ERA-2AEB103X-Panasonic-datasheet-10840895.pdf?src-supplier=Future+Electronics; ComponentLink25URL: https://datasheet.octopart.com:443/ERA-2AEB103X-Panasonic-datasheet-8367715.pdf?src-supplier=Future+Electronics; ComponentLink25Description: https://datasheet.octopart.com:443/ERA-2AEB103X-Panasonic-datasheet-8367715.pdf?src-supplier=Future+Electronics; ComponentLink26URL: https://datasheet.octopart.com:443/ERA-2AEB103X-Panasonic-datasheet-5392808.pdf?src-supplier=Future+Electronics; ComponentLink26Description: https://datasheet.octopart.com:443/ERA-2AEB103X-Panasonic-datasheet-5392808.pdf?src-supplier=Future+Electronics; ComponentLink27URL: https://datasheet.octopart.com:443/ERA-2AEB103X-Panasonic-datasheet-136531316.pdf?src-supplier=TME; ComponentLink27Description: https://datasheet.octopart.com:443/ERA-2AEB103X-Panasonic-datasheet-136531316.pdf?src-supplier=TME; ComponentLink28URL: https://datasheet.octopart.com:443/ERA2AEB103X-Panasonic-datasheet-188913046.pdf?src-supplier=TME; ComponentLink28Description: https://datasheet.octopart.com:443/ERA2AEB103X-Panasonic-datasheet-188913046.pdf?src-supplier=TME; ComponentLink29URL: https://datasheet.octopart.com:443/ERA-2AEB103X-Panasonic-datasheet-13266200.pdf?src-supplier=_legacy+Avnet; ComponentLink29Description: https://datasheet.octopart.com:443/ERA-2AEB103X-Panasonic-datasheet-13266200.pdf?src-supplier=_legacy+Avnet; ComponentLink30URL: https://datasheet.octopart.com:443/ERA2AEB103X-Panasonic-datasheet-5311861.pdf?src-supplier=Newark; ComponentLink30Description: https://datasheet.octopart.com:443/ERA2AEB103X-Panasonic-datasheet-5311861.pdf?src-supplier=Newark; ComponentLink31URL: https://datasheet.octopart.com:443/ERA-2AEB103X-Panasonic-datasheet-61114971.pdf?src-supplier=Newark; ComponentLink31Description: https://datasheet.octopart.com:443/ERA-2AEB103X-Panasonic-datasheet-61114971.pdf?src-supplier=Newark; ComponentLink32URL: https://datasheet.octopart.com:443/ERA-2AEB103X-Panasonic-datasheet-34200419.pdf?src-supplier=Newark; ComponentLink32Description: https://datasheet.octopart.com:443/ERA-2AEB103X-Panasonic-datasheet-34200419.pdf?src-supplier=Newark; ComponentLink33URL: https://datasheet.octopart.com:443/ERA-2AEB103X-Panasonic-datasheet-7542722.pdf?src-supplier=element14+APAC; ComponentLink33Description: https://datasheet.octopart.com:443/ERA-2AEB103X-Panasonic-datasheet-7542722.pdf?src-supplier=element14+APAC; ComponentLink34URL: https://datasheet.octopart.com:443/ERA-2AEB103X-Panasonic-datasheet-154766165.pdf?src-supplier=Master+Electronics; ComponentLink34Description: https://datasheet.octopart.com:443/ERA-2AEB103X-Panasonic-datasheet-154766165.pdf?src-supplier=Master+Electronics; ComponentLink35URL: https://datasheet.octopart.com:443/ERA-2AEB103X-Panasonic-datasheet-46744048.pdf?src-supplier=RS+(Formerly+Allied+Electronics); ComponentLink35Description: https://datasheet.octopart.com:443/ERA-2AEB103X-Panasonic-datasheet-46744048.pdf?src-supplier=RS+(Formerly+Allied+Electronics); ComponentLink36URL: https://sigma.octopart.com:443/150570796/technical_drawing/Panasonic-ERA2AEB103X.pdf?src-supplier=Panasonic+SCT; ComponentLink36Description: https://sigma.octopart.com:443/150570796/technical_drawing/Panasonic-ERA2AEB103X.pdf?src-supplier=Panasonic+SCT; ComponentLink37URL: https://datasheet.octopart.com/ERA-2AEB103X-Panasonic-datasheet-78375410.pdf; ComponentLink37Description: https://datasheet.octopart.com/ERA-2AEB103X-Panasonic-datasheet-78375410.pdf; ComponentLink38URL: https://datasheet.octopart.com:443/ERA2AEB103X-Panasonic---ECG-datasheet-15994758.pdf?src-supplier=Farnell; ComponentLink38Description: https://datasheet.octopart.com:443/ERA2AEB103X-Panasonic---ECG-datasheet-15994758.pdf?src-supplier=Farnell; ComponentLink39URL: https://datasheet.octopart.com:443/ERA2AEB103X-Panasonic-datasheet-10050158.pdf?src-supplier=Arrow+Electronics; ComponentLink39Description: https://datasheet.octopart.com:443/ERA2AEB103X-Panasonic-datasheet-10050158.pdf?src-supplier=Arrow+Electronics; ComponentLink40URL: https://datasheet.octopart.com:443/ERA-2AEB103X-Panasonic-datasheet-33006989.pdf?src-supplier=Electro+Sonic; ComponentLink40Description: https://datasheet.octopart.com:443/ERA-2AEB103X-Panasonic-datasheet-33006989.pdf?src-supplier=Electro+Sonic
U2 = MS560702BA03-50: SENSOR 17.4PSIA 24BIT 8SMD; Manufacturer: TE Connectivity; Package Shape/Style: Rectangular; Output Type: DIGITAL VOLTAGE; Accuracy-Max (%): 4%; Number of Bits: 24; Operating Current-Max: 1.4mA; Output Interface Type: I2C; Output Range: 0-3V; Pressure Range-Max: 15.95PSI; Pressure Range-Min: 4.351PSI; Pressure Type: Barometric; Response Time: 8220us; Sensor Type: PRESSURE SENSOR,PEIZORESISTIVE; Max Supply Voltage: 3.6V; Min Supply Voltage: 1.8V; Body Breadth: 3mm; Body Height: 0.95mm; Body Length or Diameter: 5mm; Supplier: Digikey; Supplier Part Number: 223-1198-1-ND; Manufacturer Part Number: MS560702BA03-50; RoHS: Yes; Category: Pressure Sensors; Stock: 43971; Pricing: 1=9.05, 5=8.384, 10=7.721, 25=7.436, 50=6.9272, 100=5.8731, 500=5.46908, 1000=5.89422, 3600=5.375 (USD); Mounting Technology: Surface Mount; Min Operating Temperature: -40°C; Max Operating Temperature: 85°C; Termination: Solder; Reach SVHC Compliant: No; RoHS Compliant: Yes; ComponentLink1URL: https://www.te.com:443/usa-en/product-MS560702BA03-50.datasheet.pdf?src-supplier=IHS+Markit; ComponentLink1Description: https://www.te.com:443/usa-en/product-MS560702BA03-50.datasheet.pdf?src-supplier=IHS+Markit; ComponentLink2URL: http://www.farnell.com/datasheets/1756127.pdf?src-supplier=Farnell; ComponentLink2Description: http://www.farnell.com/datasheets/1756127.pdf?src-supplier=Farnell; ComponentLink3URL: https://datasheet.octopart.com/MS560702BA03-50-TE-Connectivity-datasheet-21074431.pdf?src-supplier=Element14; ComponentLink3Description: https://datasheet.octopart.com/MS560702BA03-50-TE-Connectivity-datasheet-21074431.pdf?src-supplier=Element14; ComponentLink4URL: https://www.te.com/commerce/DocumentDelivery/DDEController?Action=srchrtrv&DocNm=MS5607-02BA03&DocType=Data+Sheet&DocLang=English&src-supplier=Digikey; ComponentLink4Description: https://www.te.com/commerce/DocumentDelivery/DDEController?Action=srchrtrv&DocNm=MS5607-02BA03&DocType=Data+Sheet&DocLang=English&src-supplier=Digikey; ComponentLink5URL: https://datasheet.octopart.com/MS560702BA03-50-TE-Connectivity-datasheet-176112741.pdf?src-supplier=Future+Electronics; ComponentLink5Description: https://datasheet.octopart.com/MS560702BA03-50-TE-Connectivity-datasheet-176112741.pdf?src-supplier=Future+Electronics; ComponentLink6URL: https://datasheet.octopart.com/MS560702BA03-50-TE-Connectivity-datasheet-65793091.pdf?src-supplier=Sager+Electronics; ComponentLink6Description: https://datasheet.octopart.com/MS560702BA03-50-TE-Connectivity-datasheet-65793091.pdf?src-supplier=Sager+Electronics; LCSC Part #: C97627
U3 = ASM330LHHTR: Accelerometer and Gyroscope 6-Axis 3D Digital-I2C/Digital-SPI-OUT 14-Pin LGA T/R; Manufacturer_Name: STMicroelectronics; Max Supply Voltage: 3.6V; Min Supply Voltage: 2V; Number of Circuits: 1; Operating Supply Voltage: 3V; Datasheet Link: https://www.st.com/resource/en/datasheet/asm330lhh.pdf; Height: 0.86mm; Manufacturer_Part_Number: ASM330LHHTR; Mouser Part Number: 511-ASM330LHHTR; Mouser Price/Stock: https://www.mouser.co.uk/ProductDetail/STMicroelectronics/ASM330LHHTR?qs=lc2O%252BfHJPVYgP8P9MzExKQ%3D%3D; Arrow Part Number: ASM330LHHTR; Arrow Price/Stock: https://www.arrow.com/en/products/asm330lhhtr/stmicroelectronics?utm_currency=USD&region=europe; Supplier: DigiKey; Supplier Part Number: 497-19078-1-ND; Manufacturer: STMicroelectronics; Manufacturer Part Number: ASM330LHHTR; RoHS: Compliant; Category: Accelerometers; Stock: 5000; Pricing: 1=7.25, 5=6.54, 10=6.275, 25=5.9592, 50=5.743, 100=5.545, 500=5.34888 (USD); China RoHS: Non-Compliant; Height - Seated (Max): 860µm; Length: 3mm; Lifecycle Status: Production; Max Operating Temperature: 105°C; Min Operating Temperature: -40°C; Number of Terminals: 14; Output Type: Digital; REACH SVHC: Yes; Terminal Pitch: 500µm; Width: 2.5mm; ComponentLink1URL: https://datasheet.octopart.com:443/ASM330LHHTR-STMicroelectronics-datasheet-181242432.pdf?src-supplier=IHS; ComponentLink1Description: https://datasheet.octopart.com:443/ASM330LHHTR-STMicroelectronics-datasheet-181242432.pdf?src-supplier=IHS; ComponentLink2URL: https://datasheet.octopart.com:443/ASM330LHHTR-STMicroelectronics-datasheet-129375621.pdf?src-supplier=ODG+(Origin+Data+Global); ComponentLink2Description: https://datasheet.octopart.com:443/ASM330LHHTR-STMicroelectronics-datasheet-129375621.pdf?src-supplier=ODG+(Origin+Data+Global); LCSC Part #: C459826
U4 = H3LIS100DLTR: ACCELEROMETER 100G I2C/SPI 16LGA; Manufacturer_Name: STMicroelectronics; Axis: X, Y, Z; Bandwidth: 200Hz; Max Supply Voltage: 3.6V; Min Supply Voltage: 2.16V; Number of Circuits: 1; Operating Supply Voltage: 2.5V; Output Type: Digital; Datasheet Link: https://www.st.com/resource/en/datasheet/h3lis100dl.pdf; Height: 1mm; Manufacturer_Part_Number: H3LIS100DLTR; Mouser Part Number: 511-H3LIS100DLTR; Mouser Price/Stock: https://www.mouser.co.uk/ProductDetail/STMicroelectronics/H3LIS100DLTR?qs=v3MacVxtdDLHj8sdza6BGw%3D%3D; Arrow Part Number: H3LIS100DLTR; Arrow Price/Stock: https://www.arrow.com/en/products/h3lis100dltr/stmicroelectronics?region=nac; Supplier: DigiKey; Supplier Part Number: 497-15697-1-ND; Manufacturer: STMicroelectronics; Manufacturer Part Number: H3LIS100DLTR; RoHS: Compliant; Category: Accelerometers; Stock: 8694; Pricing: 1=6.69, 5=6.03, 10=5.783, 25=5.4888, 50=5.2876, 100=5.1032, 500=4.88678 (USD); Case/Package: LGA; China RoHS: Non-Compliant; Height - Seated (Max): 1mm; Lead Free: Lead Free; Length: 3mm; Lifecycle Status: Production; Max Operating Temperature: 85°C; Min Operating Temperature: -40°C; Mounting Technology: Surface Mount; Pins: 16; Number of Terminals: 16; REACH SVHC: No; Schedule B: 8542390000, 8542390000|8542390000|8542390000|8542390000|8542390000|8542390000|8542390000|8542390000|8542390000|8542390000|8542390000|8542390000|8542390000|8542390000|8542390000|8542390000|8542390000|8542390000|8542390000|8542390000|8542390000|8542390000|8542390000|85; Terminal Pitch: 500µm; Width: 3mm; ComponentLink1URL: https://datasheet.octopart.com:443/H3LIS100DLTR-STMicroelectronics-datasheet-181243375.pdf?src-supplier=IHS; ComponentLink1Description: https://datasheet.octopart.com:443/H3LIS100DLTR-STMicroelectronics-datasheet-181243375.pdf?src-supplier=IHS; ComponentLink2URL: https://datasheet.octopart.com:443/H3LIS100DLTR-STMicroelectronics-datasheet-41189296.pdf?src-supplier=element14+APAC; ComponentLink2Description: https://datasheet.octopart.com:443/H3LIS100DLTR-STMicroelectronics-datasheet-41189296.pdf?src-supplier=element14+APAC; LCSC Part #: C2655068
U5 = MMC5983MA: 8 Gauss, High Performance 3-axis Magnetic Sensor Automotive AEC-Q100; Manufacturer_Name: MEMSIC; Max Supply Voltage: 3.6V; Min Supply Voltage: 2.8V; Sensing Method: Magnetoresistive; Datasheet Link: https://www.mouser.com/datasheet/2/821/Memsic_09102019_MMC5983MA_Datasheet_Rev_A-1635338.pdf; Height: 1mm; Manufacturer_Part_Number: MMC5983MA; Mouser Part Number: 438-MMC5983MA; Mouser Price/Stock: https://www.mouser.co.uk/ProductDetail/MEMSIC/MMC5983MA?qs=B6kkDfuK7%2FD5qasHMdEt2g%3D%3D; Arrow Part Number: MMC5983MA; Arrow Price/Stock: https://www.arrow.com/en/products/mmc5983ma/memsic?utm_currency=USD&region=nac; Supplier: DigiKey; Supplier Part Number: 1267-MMC5983MACT-ND; Manufacturer: Memsic; Manufacturer Part Number: MMC5983MA; RoHS: Compliant; Category: Linear ICs; Stock: 65243; Pricing: 1=2.79, 5=2.49, 10=2.378, 25=2.244, 50=2.1522, 100=2.0681, 500=1.899, 1000=1.83604 (USD); Length: 3mm; Max Operating Temperature: 105°C; Min Operating Temperature: -40°C; Mounting Technology: Surface Mount; Number of Terminals: 16; REACH SVHC: Yes; ComponentLink1URL: https://datasheet.octopart.com:443/MMC5983MA-Memsic-datasheet-180628270.pdf?src-supplier=IHS; ComponentLink1Description: https://datasheet.octopart.com:443/MMC5983MA-Memsic-datasheet-180628270.pdf?src-supplier=IHS; ComponentLink2URL: https://datasheet.octopart.com:443/MMC5983MA-Memsic-datasheet-160655074.pdf?src-supplier=Upverter; ComponentLink2Description: https://datasheet.octopart.com:443/MMC5983MA-Memsic-datasheet-160655074.pdf?src-supplier=Upverter; LCSC Part #: C404329
U6 = CMP-009-00205-1: 5V, 3A, 25M LOAD SWITCH WITH OPT; Pins: 4